# EAGLE design LedWall (EAGLE 5.06)
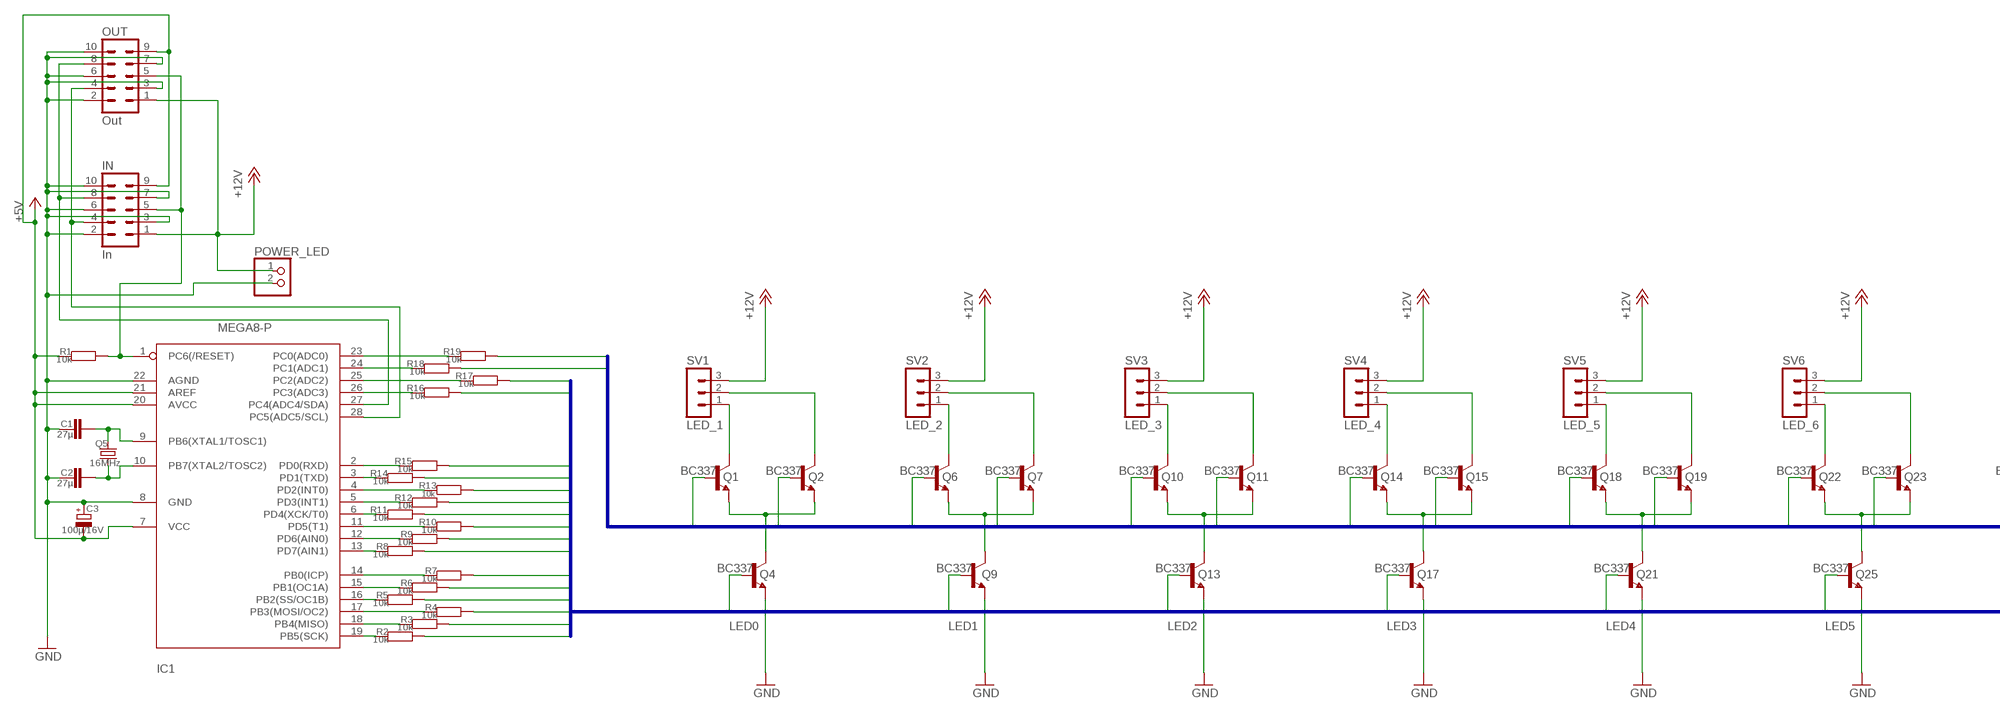
[diagram p0: schematic, sheet 1, part 1 of 2]
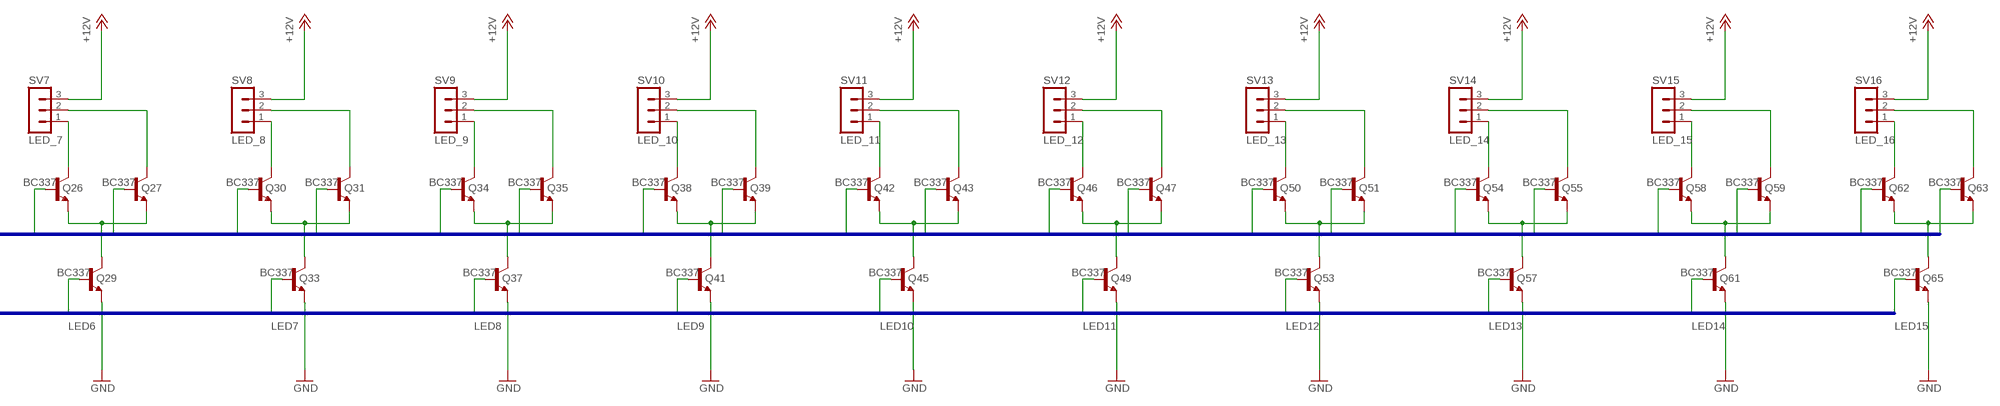
[diagram p1: schematic, sheet 1, part 2 of 2]

## Parts
C1  27µ  C-EU050-025X075  [C050-025X075]
C2  27µ  C-EU050-025X075  [C050-025X075]
C3  100µ/16V  CPOL-EUE2,5-6E  [E2,5-6E]
IC1  MEGA8-P  [DIL28-3]
IN  In  MA05-2  [MA05-2]
OUT  Out  MA05-2  [MA05-2]
POWER_LED  PINHD-1X2  [1X02]
Q1  BC337  [TO92]
Q2  BC337  [TO92]
Q4  BC337  [TO92]
Q5  16MHz  CRYSTALHC49S  [HC49/S]
Q6  BC337  [TO92]
Q7  BC337  [TO92]
Q9  BC337  [TO92]
Q10  BC337  [TO92]
Q11  BC337  [TO92]
Q13  BC337  [TO92]
Q14  BC337  [TO92]
Q15  BC337  [TO92]
Q17  BC337  [TO92]
Q18  BC337  [TO92]
Q19  BC337  [TO92]
Q21  BC337  [TO92]
Q22  BC337  [TO92]
Q23  BC337  [TO92]
Q25  BC337  [TO92]
Q26  BC337  [TO92]
Q27  BC337  [TO92]
Q29  BC337  [TO92]
Q30  BC337  [TO92]
Q31  BC337  [TO92]
Q33  BC337  [TO92]
Q34  BC337  [TO92]
Q35  BC337  [TO92]
Q37  BC337  [TO92]
Q38  BC337  [TO92]
Q39  BC337  [TO92]
Q41  BC337  [TO92]
Q42  BC337  [TO92]
Q43  BC337  [TO92]
Q45  BC337  [TO92]
Q46  BC337  [TO92]
Q47  BC337  [TO92]
Q49  BC337  [TO92]
Q50  BC337  [TO92]
Q51  BC337  [TO92]
Q53  BC337  [TO92]
Q54  BC337  [TO92]
Q55  BC337  [TO92]
Q57  BC337  [TO92]
Q58  BC337  [TO92]
Q59  BC337  [TO92]
Q61  BC337  [TO92]
Q62  BC337  [TO92]
Q63  BC337  [TO92]
Q65  BC337  [TO92]
R1  10k  R-EU_0204/7  [0204/7]
R2  10k  R-EU_0207/2V  [0207/2V]
R3  10k  R-EU_0207/2V  [0207/2V]
R4  10k  R-EU_0207/2V  [0207/2V]
R5  10k  R-EU_0207/2V  [0207/2V]
R6  10k  R-EU_0207/2V  [0207/2V]
R7  10k  R-EU_0207/2V  [0207/2V]
R8  10k  R-EU_0207/2V  [0207/2V]
R9  10k  R-EU_0207/2V  [0207/2V]
R10  10k  R-EU_0207/2V  [0207/2V]
R11  10k  R-EU_0207/2V  [0207/2V]
R12  10k  R-EU_0207/2V  [0207/2V]
R13  10k  R-EU_0207/2V  [0207/2V]
R14  10k  R-EU_0207/2V  [0207/2V]
R15  10k  R-EU_0207/2V  [0207/2V]
R16  10k  R-EU_0207/2V  [0207/2V]
R17  10k  R-EU_0207/2V  [0207/2V]
R18  10k  R-EU_0207/2V  [0207/2V]
R19  10k  R-EU_0207/2V  [0207/2V]
SV1  LED_1  MA03-1  [MA03-1]
SV2  LED_2  MA03-1  [MA03-1]
SV3  LED_3  MA03-1  [MA03-1]
SV4  LED_4  MA03-1  [MA03-1]
SV5  LED_5  MA03-1  [MA03-1]
SV6  LED_6  MA03-1  [MA03-1]
SV7  LED_7  MA03-1  [MA03-1]
SV8  LED_8  MA03-1  [MA03-1]
SV9  LED_9  MA03-1  [MA03-1]
SV10  LED_10  MA03-1  [MA03-1]
SV11  LED_11  MA03-1  [MA03-1]
SV12  LED_12  MA03-1  [MA03-1]
SV13  LED_13  MA03-1  [MA03-1]
SV14  LED_14  MA03-1  [MA03-1]
SV15  LED_15  MA03-1  [MA03-1]
SV16  LED_16  MA03-1  [MA03-1]

## Nets
+5V: C3.- IC1.7(VCC) IC1.20(AVCC) IC1.21(AREF) IN.9 OUT.9 R1.1
+12V: IN.1 OUT.1 POWER_LED.1 SV1.3 SV2.3 SV3.3 SV4.3 SV5.3 SV6.3 SV7.3 SV8.3 SV9.3 SV10.3 SV11.3 SV12.3 SV13.3 SV14.3 SV15.3 SV16.3
COLOR0: Q1.2(B) Q6.2(B) Q10.2(B) Q14.2(B) Q18.2(B) Q22.2(B) Q26.2(B) Q30.2(B) Q34.2(B) Q38.2(B) Q42.2(B) Q46.2(B) Q50.2(B) Q54.2(B) Q58.2(B) Q62.2(B) R19.2
COLOR1: Q2.2(B) Q7.2(B) Q11.2(B) Q15.2(B) Q19.2(B) Q23.2(B) Q27.2(B) Q31.2(B) Q35.2(B) Q39.2(B) Q43.2(B) Q47.2(B) Q51.2(B) Q55.2(B) Q59.2(B) Q63.2(B) R18.2
GND: C1.1 C2.1 C3.+ IC1.8(GND) IC1.22(AGND) IN.2 IN.3 IN.6 IN.7 IN.10 OUT.2 OUT.3 OUT.6 OUT.7 OUT.10 POWER_LED.2 Q4.1(E) Q9.1(E) Q13.1(E) Q17.1(E) Q21.1(E) Q25.1(E) Q29.1(E) Q33.1(E) Q37.1(E) Q41.1(E) Q45.1(E) Q49.1(E) Q53.1(E) Q57.1(E) Q61.1(E) Q65.1(E)
LED0: Q4.2(B) R17.2
LED1: Q9.2(B) R16.2
LED2: Q13.2(B) R15.2
LED3: Q17.2(B) R14.2
LED4: Q21.2(B) R13.2
LED5: Q25.2(B) R12.2
LED6: Q29.2(B) R11.2
LED7: Q33.2(B) R10.2
LED8: Q37.2(B) R9.2
LED9: Q41.2(B) R8.2
LED10: Q45.2(B) R7.2
LED11: Q49.2(B) R6.2
LED12: Q53.2(B) R5.2
LED13: Q57.2(B) R4.2
LED14: Q61.2(B) R3.2
LED15: Q65.2(B) R2.2
N$1: Q62.3(C) SV16.1
N$2: Q63.3(C) SV16.2
N$3: Q1.1(E) Q2.1(E) Q4.3(C)
N$4: Q18.1(E) Q19.1(E) Q21.3(C)
N$5: IC1.19(PB5(SCK)) R2.1
N$6: IC1.18(PB4(MISO)) R3.1
N$7: C1.2 IC1.9(PB6(XTAL1/TOSC1)) Q5.2
N$8: C2.2 IC1.10(PB7(XTAL2/TOSC2)) Q5.1
N$9: IC1.17(PB3(MOSI/OC2)) R4.1
N$11: IC1.27(PC4(ADC4/SDA)) IN.8 OUT.8
N$12: IC1.28(PC5(ADC5/SCL)) IN.4 OUT.4
N$13: IC1.16(PB2(SS/OC1B)) R5.1
N$14: IC1.15(PB1(OC1A)) R6.1
N$15: IC1.14(PB0(ICP)) R7.1
N$16: IC1.13(PD7(AIN1)) R8.1
N$17: IC1.12(PD6(AIN0)) R9.1
N$18: IC1.11(PD5(T1)) R10.1
N$19: IC1.6(PD4(XCK/T0)) R11.1
N$20: IC1.5(PD3(INT1)) R12.1
N$21: IC1.1(PC6(/RESET)) IN.5 OUT.5 R1.2
N$22: IC1.3(PD1(TXD)) R14.1
N$23: IC1.2(PD0(RXD)) R15.1
N$24: IC1.26(PC3(ADC3)) R16.1
N$25: IC1.25(PC2(ADC2)) R17.1
N$26: IC1.24(PC1(ADC1)) R18.1
N$27: IC1.23(PC0(ADC0)) R19.1
N$28: Q59.3(C) SV15.2
N$29: Q58.3(C) SV15.1
N$30: Q6.1(E) Q7.1(E) Q9.3(C)
N$31: Q22.1(E) Q23.1(E) Q25.3(C)
N$32: Q55.3(C) SV14.2
N$33: Q54.3(C) SV14.1
N$34: Q10.1(E) Q11.1(E) Q13.3(C)
N$35: Q26.1(E) Q27.1(E) Q29.3(C)
N$36: Q51.3(C) SV13.2
N$37: Q50.3(C) SV13.1
N$38: Q14.1(E) Q15.1(E) Q17.3(C)
N$39: Q30.1(E) Q31.1(E) Q33.3(C)
N$40: Q47.3(C) SV12.2
N$41: Q46.3(C) SV12.1
N$42: Q34.1(E) Q35.1(E) Q37.3(C)
N$43: Q38.1(E) Q39.1(E) Q41.3(C)
N$44: Q43.3(C) SV11.2
N$45: Q42.3(C) SV11.1
N$46: Q42.1(E) Q43.1(E) Q45.3(C)
N$47: Q46.1(E) Q47.1(E) Q49.3(C)
N$48: Q39.3(C) SV10.2
N$49: Q38.3(C) SV10.1
N$50: Q50.1(E) Q51.1(E) Q53.3(C)
N$51: Q54.1(E) Q55.1(E) Q57.3(C)
N$52: Q35.3(C) SV9.2
N$53: Q34.3(C) SV9.1
N$54: Q58.1(E) Q59.1(E) Q61.3(C)
N$55: Q62.1(E) Q63.1(E) Q65.3(C)
N$56: Q31.3(C) SV8.2
N$57: Q30.3(C) SV8.1
N$58: Q27.3(C) SV7.2
N$59: Q26.3(C) SV7.1
N$60: Q23.3(C) SV6.2
N$61: Q22.3(C) SV6.1
N$62: Q19.3(C) SV5.2
N$63: Q18.3(C) SV5.1
N$64: Q15.3(C) SV4.2
N$65: Q14.3(C) SV4.1
N$66: Q11.3(C) SV3.2
N$67: Q10.3(C) SV3.1
N$68: Q7.3(C) SV2.2
N$69: Q6.3(C) SV2.1
N$70: Q2.3(C) SV1.2
N$71: Q1.3(C) SV1.1
N$72: IC1.4(PD2(INT0)) R13.1

## Buses
LED[0..15]
COLOR[0..1]

## Library data of the parts
C1 C2 = rcl:C-EU: CAPACITOR, European symbol
C3 = rcl:CPOL-EU: POLARIZED CAPACITOR, European symbol
IC1 = atmel:MEGA8-P: MICROCONTROLLER 8 Kbytes FLASH, 1 kbytes SRAM, 512 bytes EEPROM, USART, 4-channel 10 bit ADC, 2-channel 8 bit ADC Pin compatible with Atmega48, ATMega88, ATMega168 Source: avr.lbr
IN OUT = con-lstb:MA05-2: PIN HEADER
POWER_LED = pinhead:PINHD-1X2: PIN HEADER
Q1 Q2 Q4 Q6 Q7 Q9-Q11 Q13-Q15 Q17-Q19 Q21-Q23 Q25-Q27 Q29-Q31 Q33-Q35 Q37-Q39 Q41-Q43 Q45-Q47 Q49-Q51 Q53-Q55 Q57-Q59 Q61-Q63 Q65 = transistor-npn:BC337*: NPN Transistor
Q5 = crystal:CRYSTAL: CRYSTAL
R1-R19 = rcl:R-EU_: RESISTOR, European symbol
SV1-SV16 = con-lstb:MA03-1: PIN HEADER

## Board
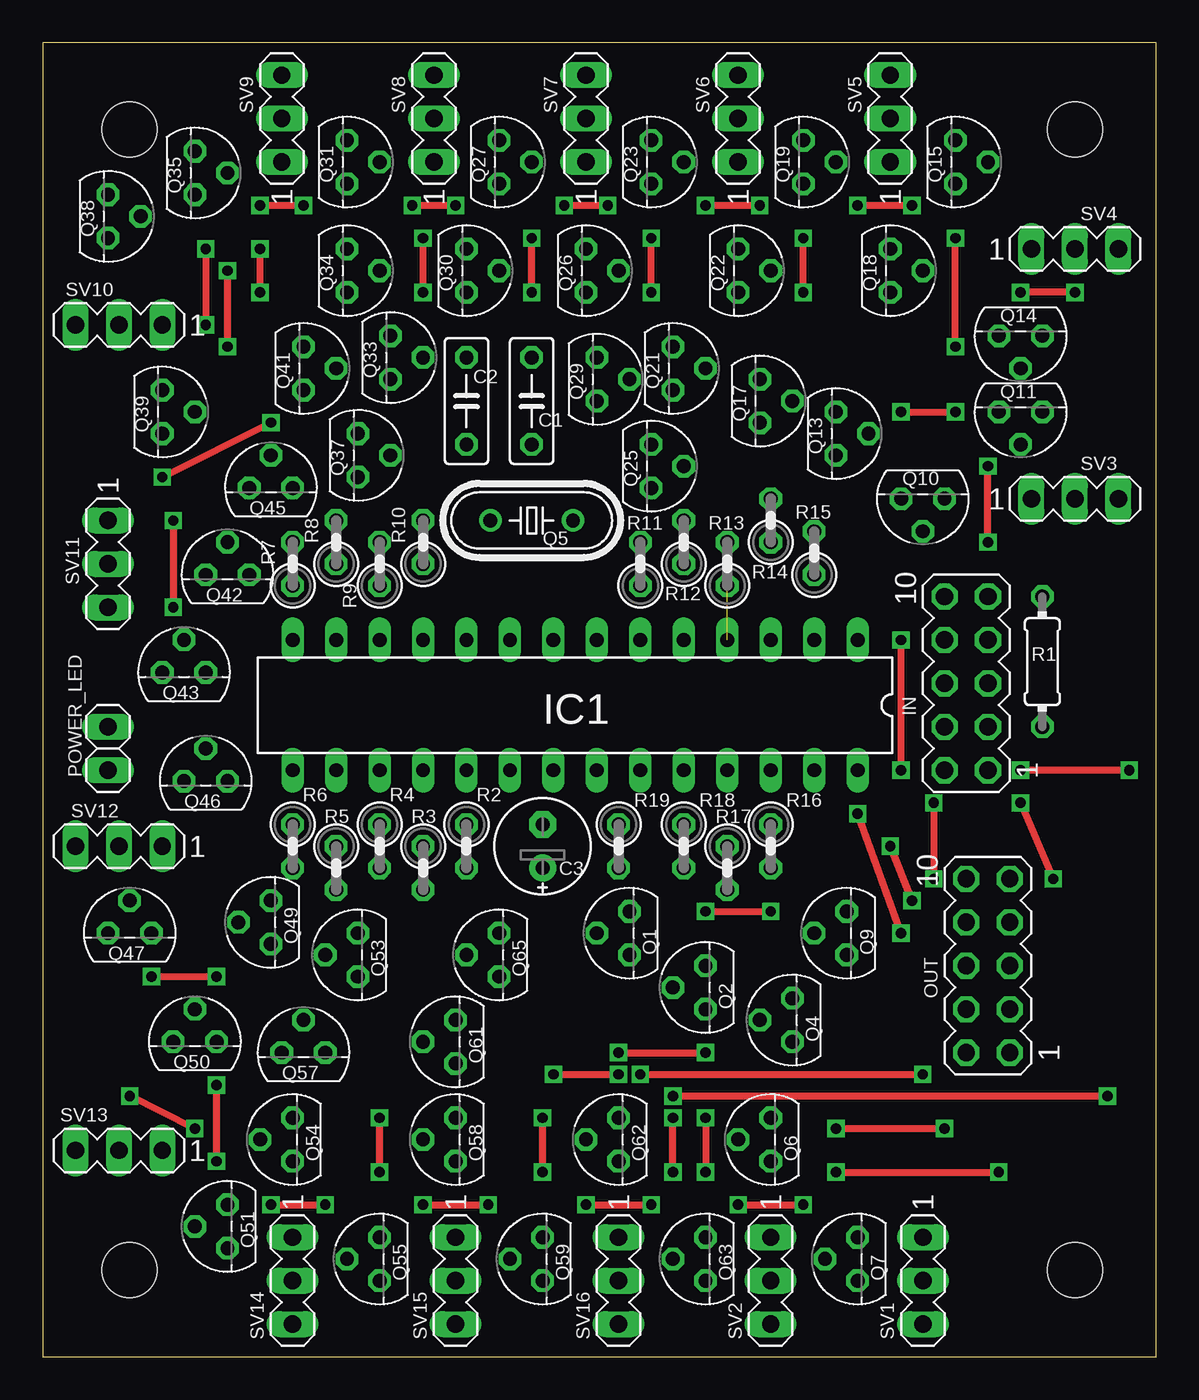
[diagram p2: board, top side]
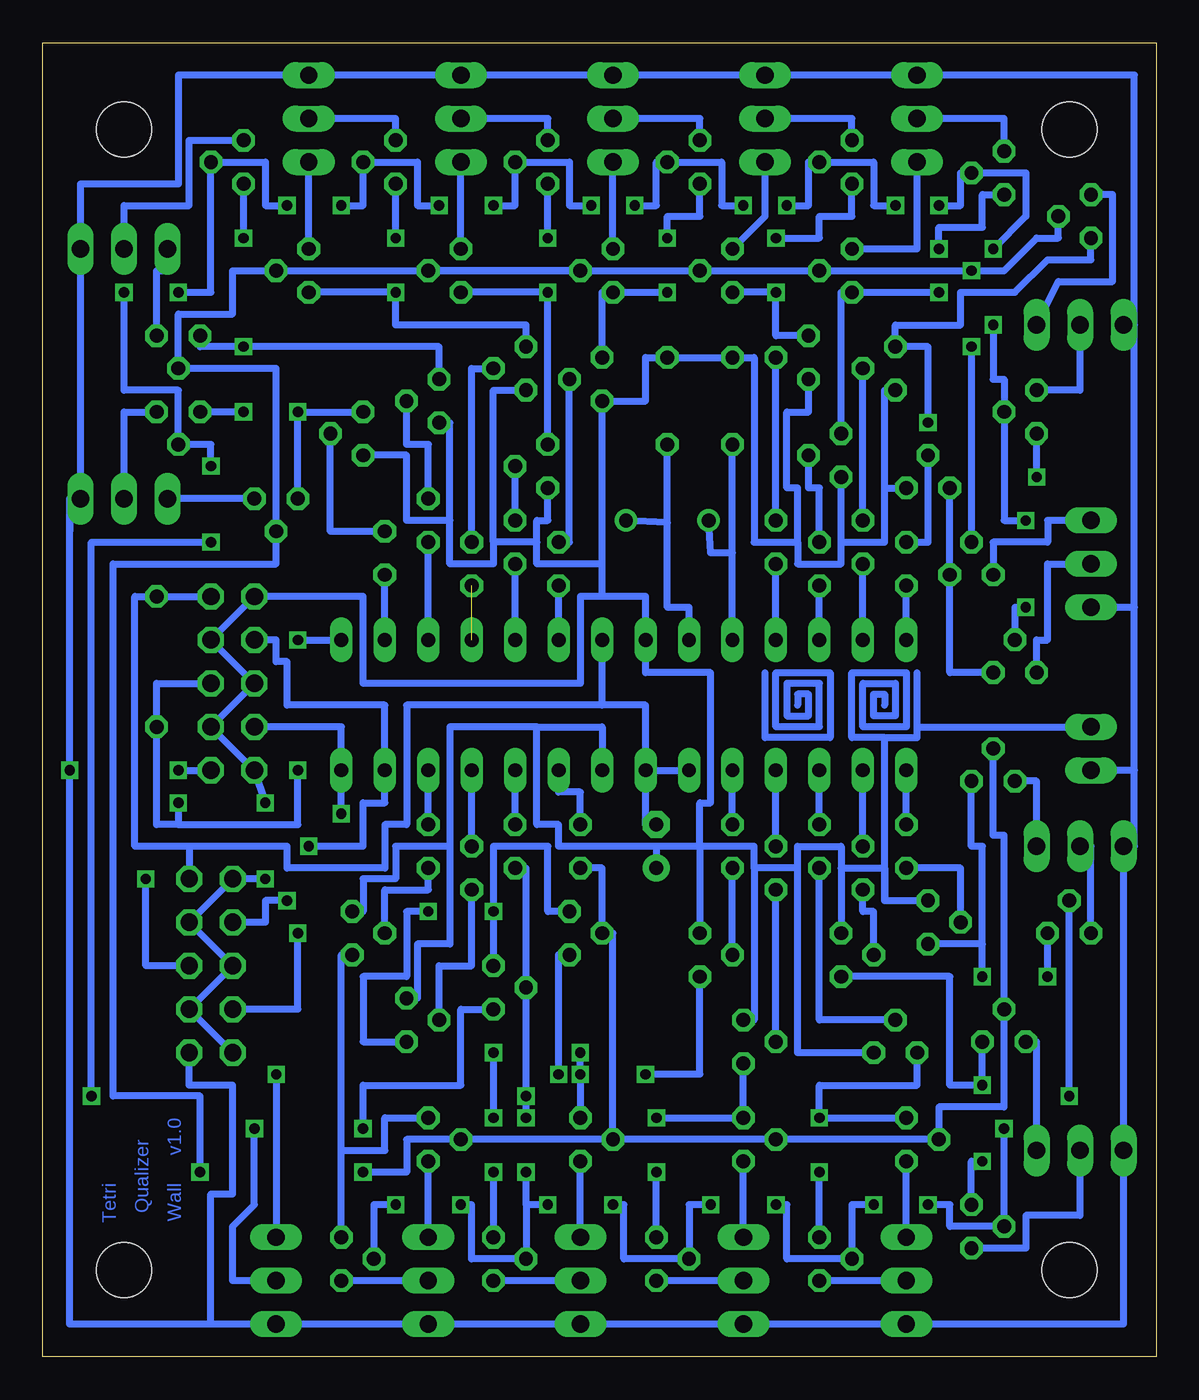
[diagram p3: board, bottom side, seen from below]

Size 65.08 x 76.83 mm. Coordinates in mm from the lower left corner, seen from the top.
Outline: 0,0 65.08,0 65.08,76.83 0,76.83 0,0
Copper layers (1*16): Top 0.035mm / dielectric 1.5mm / Bottom 0.035mm
Design rules "default *": minimum track width 10mil, minimum drill 12mil, track to track 8mil, track to pad 8mil, pad to pad 8mil, via to via 8mil, smd to smd 8mil, copper to edge 40mil, drill to drill 8mil, minimum pad ring 10mil, minimum via ring 8mil, stop-mask expansion 4mil, vias tented up to drill 0mil, thermal gap 10mil
Holes 3.2 mm at 60.33,5.08 60.33,71.75 5.08,71.75 5.08,5.08

### Footprints (pad centres in the part's own frame; a part is rotated, then mirrored left to right if it is on the bottom)
C050-025X075 = drill 0.813 octagon: 1 -2.54,0; 2 2.54,0
E2,5-6E = drill 0.813 pad 1.575 round: + -1.27,0 | drill 0.813 pad 1.575 octagon: - 1.27,0
DIL28-3 = drill 0.813 long: 1 -16.51,-3.81; 2 -13.97,-3.81; 3 -11.43,-3.81; 4 -8.89,-3.81; 5 -6.35,-3.81; 6 -3.81,-3.81; 7 -1.27,-3.81; 8 1.27,-3.81; 9 3.81,-3.81; 10 6.35,-3.81; 11 8.89,-3.81; 12 11.43,-3.81; 13 13.97,-3.81; 14 16.51,-3.81; 15 16.51,3.81; 16 13.97,3.81; 17 11.43,3.81; 18 8.89,3.81; 19 6.35,3.81; 20 3.81,3.81; 21 1.27,3.81; 22 -1.27,3.81; 23 -3.81,3.81; 24 -6.35,3.81; 25 -8.89,3.81; 26 -11.43,3.81; 27 -13.97,3.81; 28 -16.51,3.81
MA05-2 = drill 1.016 octagon: 1 -5.08,-1.27; 2 -5.08,1.27; 3 -2.54,-1.27; 4 -2.54,1.27; 5 0,-1.27; 6 0,1.27; 7 2.54,-1.27; 8 2.54,1.27; 9 5.08,-1.27; 10 5.08,1.27
1X02 = drill 1.016 long: 1 -1.27,0; 2 1.27,0
TO92 = drill 0.813 octagon: 1 1.27,0; 2 0,1.905; 3 -1.27,0
HC49/S = drill 0.813 round: 1 -2.413,0; 2 2.413,0
0204/7 = drill 0.813 octagon: 1 -3.81,0; 2 3.81,0
0207/2V = drill 0.813 octagon: 1 -1.27,0; 2 1.27,0
MA03-1 = drill 1.016 long: 1 -2.54,0; 2 0,0; 3 2.54,0

### Placement (x,y rotation side)
C1  28.57,55.88 270 top
C2  24.77,55.88 270 top
C3  29.21,29.84 90 top
IC1  31.11,38.1 180 top
IN  53.98,39.37 90 top
OUT  55.24,22.86 90 top
POWER_LED  3.81,35.56 90 top
Q1  34.29,24.77 90 top
Q2  38.73,21.59 90 top
Q4  43.81,19.68 90 top
Q5  28.57,48.9 0 top
Q6  42.55,12.7 90 top
Q7  47.62,5.71 90 top
Q9  46.99,24.77 90 top
Q10  51.44,50.16 180 top
Q11  57.15,55.24 180 top
Q13  46.35,53.98 270 top
Q14  57.15,59.69 180 top
Q15  53.34,69.85 270 top
Q17  41.91,55.88 270 top
Q18  49.53,63.5 270 top
Q19  44.45,69.85 270 top
Q21  36.83,57.78 270 top
Q22  40.64,63.5 270 top
Q23  35.56,69.85 270 top
Q25  35.56,52.07 270 top
Q26  31.75,63.5 270 top
Q27  26.67,69.85 270 top
Q29  32.38,57.15 270 top
Q30  24.77,63.5 270 top
Q31  17.78,69.85 270 top
Q33  20.32,58.42 270 top
Q34  17.78,63.5 270 top
Q35  8.89,69.22 270 top
Q37  18.41,52.7 270 top
Q38  3.81,66.67 270 top
Q39  6.99,55.24 270 top
Q41  15.24,57.78 270 top
Q42  10.79,45.72 0 top
Q43  8.26,40.01 0 top
Q45  13.34,50.8 0 top
Q46  9.53,33.66 0 top
Q47  5.08,24.77 0 top
Q49  13.34,25.4 90 top
Q50  8.89,18.41 0 top
Q51  10.79,7.62 90 top
Q53  18.41,23.5 90 top
Q54  14.61,12.7 90 top
Q55  19.68,5.71 90 top
Q57  15.24,17.78 0 top
Q58  24.13,12.7 90 top
Q59  29.21,5.71 90 top
Q61  24.13,18.41 90 top
Q62  33.66,12.7 90 top
Q63  38.73,5.71 90 top
Q65  26.67,23.5 90 top
R1  58.42,40.64 270 top
R2  24.77,29.84 270 top
R3  22.23,28.57 270 top
R4  19.68,29.84 270 top
R5  17.14,28.57 270 top
R6  14.61,29.84 270 top
R7  14.61,46.35 90 top
R8  17.14,47.62 90 top
R9  19.68,46.35 90 top
R10  22.23,47.62 90 top
R11  34.92,46.35 90 top
R12  37.47,47.62 90 top
R13  40.01,46.35 90 top
R14  42.55,48.9 90 top
R15  45.09,46.99 90 top
R16  42.55,29.84 270 top
R17  40.01,28.57 270 top
R18  37.47,29.84 270 top
R19  33.66,29.84 270 top
SV1  51.44,4.45 270 top
SV2  42.55,4.45 270 top
SV3  60.33,50.16 0 top
SV4  60.33,64.77 0 top
SV5  49.53,72.39 90 top
SV6  40.64,72.39 90 top
SV7  31.75,72.39 90 top
SV8  22.86,72.39 90 top
SV9  13.97,72.39 90 top
SV10  4.45,60.33 180 top
SV11  3.81,46.35 270 top
SV12  4.45,29.84 180 top
SV13  4.45,12.06 180 top
SV14  14.61,4.45 270 top
SV15  24.13,4.45 270 top
SV16  33.66,4.45 270 top

### Tracks (layer width: path | path; a pad name or v marks a point on that pad's centre or on a via)
+5V
  Bottom 0.406: 32.38,38.1 IC1.7 | 32.38,38.1 43.81,38.1 43.81,31.11 45.09,31.11 45.09,28.57 50.8,28.57 50.8,29.84 56.52,29.84 | IC1.21 IC1.20 | 56.52,29.84 59.69,29.84 59.69,44.45 R1.1 IN.9 | 56.52,29.84 OUT.9 | 32.38,38.1 29.84,38.1 IC1.21 | C3.- 29.84,31.11 IC1.21
+12V  (via drill 0.6)
  Top 0.406: v63.5,34.29 v57.15,34.29
  Bottom 0.406: 1.27,60.33 1.27,74.93 SV9.3 SV8.3 SV7.3 SV6.3 SV5.3 57.15,74.93 57.15,68.58 62.87,68.58 SV4.3 SV3.3 63.5,50.16 63.5,49.53 | 1.27,60.33 SV10.3 | 1.27,43.81 1.27,60.33 | 55.24,1.91 SV1.3 SV2.3 SV16.3 SV15.3 SV14.3 1.91,1.91 SV13.3 SV12.3 1.27,29.84 1.27,34.29 | 55.24,1.91 63.5,1.91 v63.5,34.29 63.5,49.53 | 63.5,49.53 63.5,48.26 | v57.15,34.29 IN.1 | 1.27,43.81 SV11.3 | OUT.1 56.52,15.88 53.98,15.88 53.98,9.53 55.24,9.53 55.24,1.91 | 1.27,34.29 POWER_LED.1 | 1.27,34.29 1.27,43.81
COLOR0  (via drill 0.6)
  Top 0.406: v46.35,10.79 v55.88,10.79 | v10.79,63.5 v10.79,59.05
  Bottom 0.406: Q26.2 Q22.2 | Q26.2 Q18.2 53.98,63.5 53.98,60.96 57.15,60.96 Q14.2 51.44,57.78 Q10.2 51.44,46.35 60.96,46.35 60.96,15.24 55.88,15.24 v55.88,10.79 | Q26.2 Q30.2 Q34.2 v10.79,63.5 8.89,63.5 6.99,65.41 5.71,65.41 Q38.2 | v10.79,59.05 Q42.2 | Q62.2 Q58.2 Q54.2 12.7,14.61 8.89,14.61 Q50.2 8.89,30.48 9.53,30.48 Q46.2 | Q62.2 Q6.2 | R19.2 32.38,28.57 Q1.2 31.75,24.77 Q62.2 | Q62.2 Q6.2 | v46.35,10.79 43.81,10.79 43.81,12.7 Q6.2
COLOR1  (via drill 0.6)
  Top 0.406: v60.33,62.23 v57.15,62.23 | v50.8,67.31 v47.62,67.31 | v41.91,67.31 v38.73,67.31 | v33.02,67.31 v30.48,67.31 | v24.13,67.31 v21.59,67.31 | v15.24,67.31 v12.7,67.31 | v9.53,64.77 v9.53,60.33 | v7.62,48.9 v7.62,43.81 | v31.75,8.89 v35.56,8.89 | v22.23,8.89 v26.04,8.89 | v13.34,8.89 v16.51,8.89 | v8.89,13.34 v5.08,15.24 | v40.64,8.89 v44.45,8.89 | v36.83,10.79 v36.83,13.97 | v36.83,15.24 v62.23,15.24 | v55.24,47.62 v55.24,52.07
  Bottom 0.406: v57.15,62.23 55.24,62.23 Q15.2 52.07,69.85 52.07,67.31 v50.8,67.31 | v60.33,62.23 60.33,56.52 57.15,56.52 Q11.2 55.24,53.34 v55.24,52.07 | v47.62,67.31 46.35,67.31 Q19.2 43.18,69.85 43.18,67.31 v41.91,67.31 | v38.73,67.31 37.47,67.31 Q23.2 34.29,69.85 34.29,67.31 v33.02,67.31 | v30.48,67.31 29.21,67.31 29.21,69.85 Q27.2 25.4,69.85 25.4,67.31 v24.13,67.31 | v21.59,67.31 20.32,67.31 20.32,69.85 Q31.2 16.51,69.85 16.51,67.31 v15.24,67.31 | v12.7,67.31 11.43,67.31 11.43,69.22 Q35.2 7.62,69.22 7.62,66.67 v9.53,64.77 | v9.53,60.33 9.53,57.15 8.89,57.15 Q39.2 8.89,48.9 v7.62,48.9 | Q43.2 8.26,43.81 v7.62,43.81 | 36.83,8.89 Q63.2 40.01,5.71 40.01,8.89 v40.64,8.89 | v35.56,8.89 36.83,8.89 | v31.75,8.89 31.11,8.89 31.11,5.71 Q59.2 27.3,8.89 v26.04,8.89 | v22.23,8.89 21.59,8.89 21.59,5.71 Q55.2 17.78,8.89 v16.51,8.89 | v13.34,8.89 12.06,8.89 12.06,7.62 Q51.2 v8.89,13.34 | v5.08,15.24 Q47.2 | v44.45,8.89 45.72,8.89 Q7.2 | 36.83,8.89 v36.83,10.79 | v36.83,13.97 v36.83,15.24 Q2.2 36.83,28.57 R18.2 | v62.23,15.24 62.23,47.62 v55.24,47.62
GND  (via drill 0.6)
  Top 0.406: v52.07,32.38 v52.07,27.94
  Bottom 0.406: 32.38,44.45 29.84,44.45 IC1.8 29.84,40.01 26.04,40.01 26.04,32.38 26.67,32.38 26.67,29.84 | 32.38,44.45 33.66,44.45 33.66,39.37 46.35,39.37 46.35,44.45 IN.10 IN.7 IN.6 IN.3 IN.2 v52.07,32.38 | 32.38,46.35 Q29.1 29.84,55.88 29.84,58.42 C1.1 C2.1 23.5,58.42 23.5,47.62 20.95,47.62 | 32.38,46.35 36.2,46.35 36.2,47.62 | 36.2,47.62 36.2,48.9 35.56,48.9 Q25.1 | 41.27,48.9 41.27,54.61 Q17.1 | 41.27,48.9 43.81,48.9 43.81,52.7 Q13.1 | 36.2,47.62 38.73,47.62 | 41.27,48.9 41.27,46.35 38.73,46.35 38.73,47.62 | 15.88,50.8 Q45.1 | 18.41,47.62 15.88,47.62 15.88,50.8 | 18.41,47.62 Q37.1 | Q33.1 20.32,55.24 21.59,55.24 21.59,50.8 20.95,50.8 20.95,47.62 | 20.95,47.62 20.95,46.35 18.41,46.35 18.41,47.62 | 15.88,50.8 15.88,56.52 Q41.1 | Q21.1 38.73,56.52 38.73,47.62 | 41.27,29.84 44.45,29.84 44.45,27.94 46.35,27.94 46.35,26.04 Q9.1 | Q4.1 43.18,20.95 43.18,24.13 41.27,24.13 41.27,29.84 | 41.27,29.84 41.27,36.83 36.2,36.83 | 36.2,36.83 36.2,31.11 34.92,31.11 34.92,29.84 29.21,29.84 | 26.67,29.84 29.21,29.84 | 15.88,26.67 15.88,28.57 18.41,28.57 18.41,29.84 | 26.67,29.84 23.5,29.84 23.5,28.57 | 20.95,28.57 23.5,28.57 | 18.41,29.84 20.95,29.84 20.95,28.57 | 18.41,29.84 Q53.1 | Q57.1 20.95,17.78 20.95,28.57 | Q61.1 23.5,19.68 23.5,28.57 | 26.67,29.84 Q65.1 | 32.38,44.45 32.38,46.35 | OUT.2 OUT.3 OUT.6 OUT.7 OUT.10 v52.07,27.94 | IC1.22 32.38,36.83 36.2,36.83 | 29.21,29.84 C3.+ | 15.88,26.67 Q49.1 | 15.88,26.67 15.88,36.2 | 15.88,36.2 13.97,36.2 13.97,36.83 | 13.97,36.83 POWER_LED.2 | 15.88,38.1 15.88,38.73 16.51,38.73 16.51,37.47 15.24,37.47 15.24,39.37 17.14,39.37 17.14,36.83 14.61,36.83 14.61,40.01 17.78,40.01 17.78,36.2 15.88,36.2
  Bottom 0.406: 13.97,36.83 13.97,40.01
LED0
  Bottom 0.406: Q4.2 41.91,22.86 40.01,22.86 R17.2
LED1
  Bottom 0.406: R16.2 42.55,27.3 45.09,27.3 Q9.2
LED2
  Bottom 0.406: R15.2 48.26,48.26 Q13.2
LED3
  Bottom 0.406: R14.2 42.55,53.34 43.81,53.34 Q17.2
LED4
  Bottom 0.406: R13.2 40.01,57.78 Q21.2
LED5
  Bottom 0.406: R12.2 Q25.2
LED6
  Bottom 0.406: R11.2 34.29,47.62 Q29.2
LED7
  Bottom 0.406: R10.2 Q33.2
LED8
  Bottom 0.406: R9.2 19.68,50.8 20.32,50.8 Q37.2
LED9
  Bottom 0.406: R8.2 Q41.2
LED10
  Bottom 0.406: R7.2 13.34,47.62 Q45.2
LED11
  Bottom 0.406: Q49.2 11.43,28.57 R6.2
LED12
  Bottom 0.406: Q53.2 16.51,26.04 17.14,26.04 R5.2
LED13
  Bottom 0.406: Q57.2 19.68,19.68 R4.2
LED14
  Bottom 0.406: Q61.2 R3.2
LED15
  Bottom 0.406: Q65.2 R2.2
N$1
  Bottom 0.406: SV16.1 Q62.3
N$2
  Bottom 0.406: SV16.2 Q63.3
N$3  (via drill 0.6)
  Top 0.406: v38.73,26.04 v42.55,26.04
  Bottom 0.406: Q1.1 35.56,26.04 35.56,29.84 38.73,29.84 v38.73,26.04 Q2.1 | v42.55,26.04 43.81,26.04 43.81,22.23 46.35,22.23 46.35,18.41 Q4.3
N$4  (via drill 0.6)
  Top 0.406: v44.45,62.23 v44.45,65.41
  Bottom 0.406: v44.45,65.41 Q19.1 | Q18.1 v44.45,62.23 44.45,60.33 36.83,60.33 Q21.3
N$5
  Bottom 0.406: R2.1 IC1.19
N$6
  Bottom 0.406: R3.1 IC1.18
N$7
  Bottom 0.406: IC1.9 27.3,43.81 28.57,43.81 28.57,48.77 | 28.57,48.77 Q5.2 | 28.57,48.77 C1.2
N$8
  Bottom 0.406: IC1.10 24.77,46.99 | 24.77,46.99 C2.2 | Q5.1 26.04,46.99 24.77,46.99
N$9
  Bottom 0.406: R4.1 IC1.17
N$10
  Bottom 0.406: 22.86,40.01 22.86,36.2 19.05,36.2 19.05,40.01 22.23,40.01 22.23,36.83 19.68,36.83 19.68,39.37 21.59,39.37 21.59,37.47 20.32,37.47 20.32,38.73 20.95,38.73 20.95,38.1
N$11  (via drill 0.6)
  Top 0.406: v49.53,29.84 v50.8,26.67
  Bottom 0.406: IN.8 51.44,41.91 51.44,40.64 50.8,40.64 50.8,38.1 45.09,38.1 IC1.27 45.09,32.38 46.35,32.38 46.35,29.84 v49.53,29.84 | v50.8,26.67 52.07,26.67 52.07,25.4 OUT.8
N$12  (via drill 0.6)
  Top 0.406: v50.16,24.77 v47.62,31.75
  Bottom 0.406: IN.4 47.62,36.83 IC1.28 v47.62,31.75 | OUT.4 50.16,20.32 v50.16,24.77
N$13
  Bottom 0.406: R5.1 IC1.16
N$14
  Bottom 0.406: R6.1 IC1.15
N$15
  Bottom 0.406: IC1.14 R7.1
N$16
  Bottom 0.406: IC1.13 R8.1
N$17
  Bottom 0.406: IC1.12 R9.1
N$18
  Bottom 0.406: IC1.11 R10.1
N$19
  Bottom 0.406: IC1.6 R11.1
N$20
  Bottom 0.406: IC1.5 R12.1
N$21  (via drill 0.6)
  Top 0.406: v50.16,34.29 v50.16,41.91 | v59.05,27.94 v57.15,32.38
  Bottom 0.406: v50.16,34.29 50.16,31.11 57.15,31.11 | 57.15,31.11 58.42,31.11 R1.2 58.42,39.37 IN.5 | OUT.5 59.05,22.86 v59.05,27.94 | v50.16,41.91 IC1.1 | v57.15,32.38 57.15,31.11
N$22
  Bottom 0.406: IC1.3 R14.1
N$23
  Bottom 0.406: IC1.2 R15.1
N$24
  Bottom 0.406: R16.1 IC1.26
N$25
  Bottom 0.406: R17.1 IC1.25
N$26
  Bottom 0.406: R18.1 IC1.24
N$27
  Bottom 0.406: R19.1 33.66,33.02 34.92,33.02 IC1.23
N$28
  Bottom 0.406: SV15.2 Q59.3
N$29
  Bottom 0.406: SV15.1 Q58.3
N$30
  Bottom 0.406: Q7.1 47.62,12.06 | 47.62,12.06 47.62,23.5 Q9.3 | 47.62,12.06 45.09,12.06 45.09,13.97 Q6.1
N$31  (via drill 0.6)
  Top 0.406: v35.56,62.23 v35.56,65.41
  Bottom 0.406: v35.56,62.23 Q22.1 v35.56,62.23 | Q25.3 v35.56,62.23 | v35.56,65.41 Q23.1
N$32
  Bottom 0.406: SV14.2 Q55.3
N$33
  Bottom 0.406: SV14.1 Q54.3
N$34  (via drill 0.6)
  Top 0.406: v50.16,55.24 v53.34,55.24
  Bottom 0.406: Q13.3 v50.16,55.24 Q10.1 | v53.34,55.24 Q11.1
N$35  (via drill 0.6)
  Top 0.406: v28.57,62.23 v28.57,65.41
  Bottom 0.406: Q29.3 32.38,62.23 Q26.1 v28.57,62.23 | v28.57,65.41 28.57,66.67 26.67,66.67 Q27.1
N$36
  Bottom 0.406: SV13.2 4.45,8.26 7.62,8.26 7.62,6.35 Q51.3
N$37
  Bottom 0.406: SV13.1 6.99,18.41 Q50.3
N$38  (via drill 0.6)
  Top 0.406: v53.34,59.05 v53.34,65.41
  Bottom 0.406: Q14.1 55.88,59.05 v53.34,59.05 41.91,59.05 Q17.3 | v53.34,65.41 Q15.1
N$39  (via drill 0.6)
  Top 0.406: v22.23,62.23 v22.23,65.41
  Bottom 0.406: v22.23,62.23 22.23,59.69 Q33.3 | v22.23,62.23 Q30.1 v22.23,62.23 | v22.23,65.41 19.68,65.41 19.68,66.67 17.78,66.67 Q31.1
N$40
  Bottom 0.406: Q47.3 3.81,29.84 SV12.2
N$41
  Bottom 0.406: Q46.3 6.99,33.66 SV12.1
N$42  (via drill 0.6)
  Top 0.406: v12.7,62.23 v12.7,64.77
  Bottom 0.406: Q37.3 18.41,62.23 Q34.1 v12.7,62.23 | v12.7,64.77 12.7,66.04 10.79,66.04 10.16,66.04 10.16,67.94 Q35.1
N$43  (via drill 0.6)
  Top 0.406: v6.99,51.44 v13.34,54.61
  Bottom 0.406: Q38.1 3.81,64.14 6.35,64.14 8.26,62.23 11.43,62.23 11.43,60.33 15.24,60.33 Q41.3 13.34,59.05 v13.34,54.61 | v6.99,51.44 Q39.1
N$44
  Bottom 0.406: SV11.2 6.35,46.35 6.35,41.91 6.99,41.91 Q43.3
N$45
  Bottom 0.406: Q42.3 9.53,47.62 6.35,47.62 6.35,48.9 SV11.1
N$46
  Bottom 0.406: Q45.3 Q42.1 12.06,40.01 Q43.1
N$47  (via drill 0.6)
  Top 0.406: v6.35,22.23 v10.16,22.23
  Bottom 0.406: v6.35,22.23 Q47.1 | 10.16,24.13 10.16,29.84 10.79,29.84 Q46.1 | v10.16,22.23 10.16,24.13 | 10.16,24.13 Q49.3
N$48
  Bottom 0.406: Q39.3 4.45,56.52 SV10.2
N$49
  Bottom 0.406: Q38.3 2.54,67.94 2.54,62.87 5.71,62.87 SV10.1
N$50  (via drill 0.6)
  Top 0.406: v10.16,11.43 v10.16,15.88
  Bottom 0.406: Q51.1 10.79,11.43 v10.16,11.43 | Q50.1 v10.16,15.88 12.06,15.88 12.06,22.23 Q53.3
N$51  (via drill 0.6)
  Top 0.406: v19.68,10.79 v19.68,13.97
  Bottom 0.406: Q55.1 v19.68,10.79 | Q54.1 v19.68,13.97 19.68,15.88 13.97,15.88 Q57.3
N$52
  Bottom 0.406: Q35.3 8.89,72.39 SV9.2
N$53
  Bottom 0.406: Q34.3 13.97,64.77 SV9.1
N$54  (via drill 0.6)
  Top 0.406: v29.21,10.79 v29.21,13.97
  Bottom 0.406: Q59.1 v29.21,10.79 | v29.21,13.97 Q58.1 Q61.3
N$55  (via drill 0.6)
  Top 0.406: v38.73,13.97 v38.73,10.79 | v33.66,17.78 v38.73,17.78 | v29.84,16.51 v33.66,16.51
  Bottom 0.406: v38.73,10.79 Q63.1 | v38.73,17.78 v38.73,13.97 | v33.66,17.78 v33.66,16.51 Q62.1 | v29.84,16.51 26.67,16.51 Q65.3
N$56
  Bottom 0.406: Q31.3 17.78,72.39 SV8.2
N$57
  Bottom 0.406: SV8.1 22.86,66.67 Q30.3
N$58
  Bottom 0.406: Q27.3 26.67,72.39 SV7.2
N$59
  Bottom 0.406: Q26.3 SV7.1
N$60
  Bottom 0.406: Q23.3 35.56,72.39 SV6.2
N$61
  Bottom 0.406: Q22.3 SV6.1
N$62
  Bottom 0.406: SV5.2 44.45,72.39 Q19.3
N$63
  Bottom 0.406: Q18.3 SV5.1
N$64
  Bottom 0.406: Q15.3 56.52,71.12 56.52,67.31 60.33,67.31 SV4.2
N$65
  Bottom 0.406: Q14.3 58.42,63.5 57.78,63.5 SV4.1
N$66
  Bottom 0.406: Q11.3 60.33,55.24 SV3.2
N$67
  Bottom 0.406: Q10.3 SV3.1
N$68
  Bottom 0.406: SV2.2 Q7.3
N$69
  Bottom 0.406: SV2.1 Q6.3
N$70  (via drill 0.6)
  Top 0.406: v52.7,13.34 v46.35,13.34
  Bottom 0.406: Q2.3 40.64,20.32 40.64,15.88 46.35,15.88 v46.35,13.34 | v52.7,13.34 52.7,8.89 53.98,7.62 53.98,4.45 SV1.2
N$71  (via drill 0.6)
  Top 0.406: v34.92,16.51 v51.44,16.51
  Bottom 0.406: Q1.3 34.92,23.5 v34.92,16.51 | v51.44,16.51 SV1.1
N$72  (1 unrouted)

### Text on the board
Bottom: v1.0 | Qualizer | Wall | Tetri